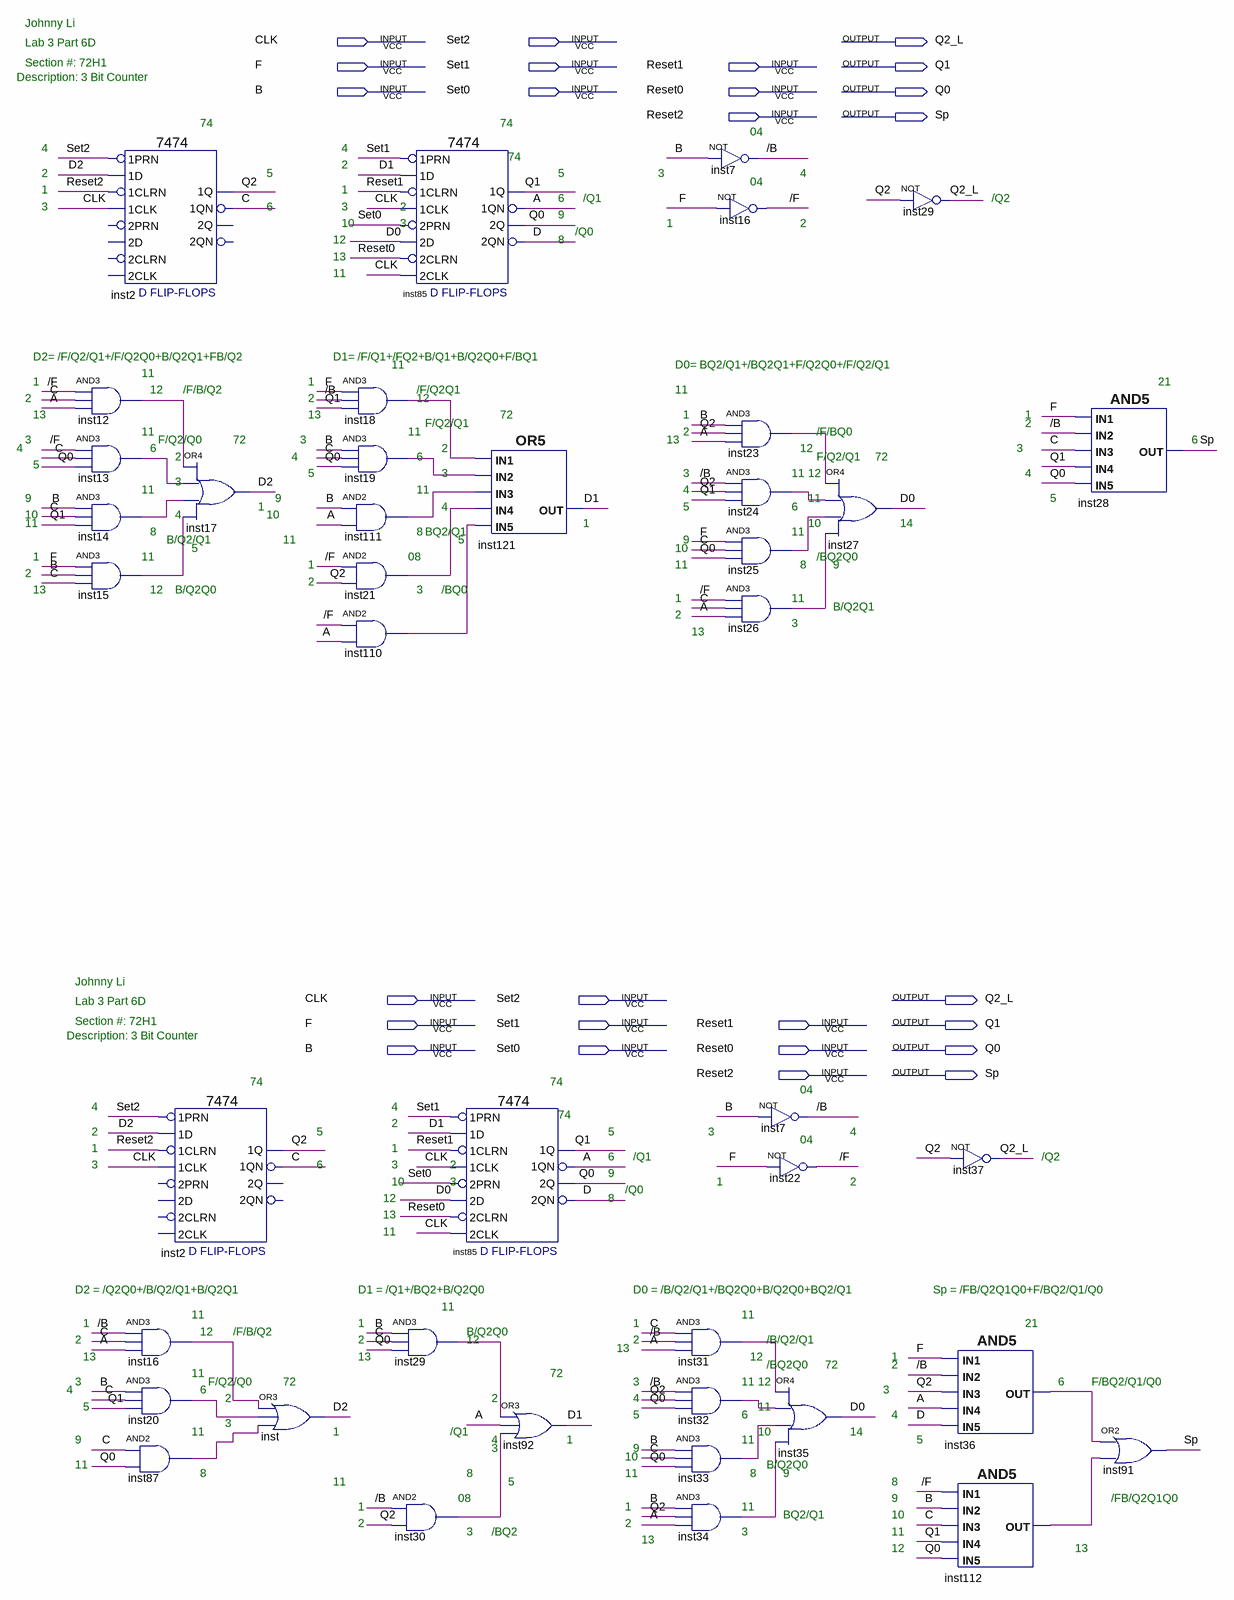
[diagram p0: schematic sheet]
// Quartus schematic test.bdf as structural Verilog: 42 symbols, 26 pins
module test (
  input  CLK,
  input  Set2,
  input  F,
  input  Set1,
  input  Reset1,
  input  B,
  input  Set0,
  input  Reset0,
  input  Reset2,
  output Q2_L,
  output Q1,
  output Q0,
  output Sp
);

  wire \/B , \/F , A, C, D, D0, D1, D2, inst12_out, inst13_out, inst14_out, inst15_out, inst16_out,
       inst18_out, inst19_out, inst20_out, inst21_out, inst23_out, inst24_out, inst25_out, inst26_out,
       inst29_out, inst30_out, inst31_out, inst32_out, inst33_out, inst34_out, inst36_out, inst87_out,
       inst110_out, inst111_out, inst112_out, Q2;

  \7474  inst2 (
    .\1CLK (CLK), .\1D (D2), .\1PRN (Set2), .\1CLRN (Reset2), .\1QN (C), .\1Q (Q2));  // open: 2D, 2PRN, 2CLK, 2CLRN, 2Q, 2QN
  and inst12 (inst12_out, \/F , C, A);
  and inst13 (inst13_out, \/F , C, Q0);
  and inst14 (inst14_out, B, C, Q1);
  and inst15 (inst15_out, F, B, C);
  and inst16 (inst16_out, \/B , C, A);
  and inst20 (inst20_out, B, C, Q1);
  and inst87 (inst87_out, C, Q0);
  or inst17 (D2, inst12_out, inst13_out, inst14_out, inst15_out);
  \7474  inst2_dup2 (
    .\1CLK (CLK), .\1D (D2), .\1PRN (Set2), .\1CLRN (Reset2), .\1QN (C), .\1Q (Q2));  // open: 2D, 2PRN, 2CLK, 2CLRN, 2Q, 2QN
  or inst (D2, inst16_out, inst20_out, inst87_out);
  and inst18 (inst18_out, F, \/B , Q1);
  and inst19 (inst19_out, B, C, Q0);
  and inst111 (inst111_out, B, A);
  and inst21 (inst21_out, \/F , Q2);
  and inst110 (inst110_out, \/F , A);
  and inst29 (inst29_out, B, C, Q0);
  and inst30 (inst30_out, \/B , Q2);
  \7474  inst85 (
    .\2D (D0), .\2PRN (Set0), .\1CLK (CLK), .\1D (D1), .\1PRN (Set1), .\2CLK (CLK), .\2CLRN (Reset0),
    .\1CLRN (Reset1), .\1QN (A), .\2Q (Q0), .\2QN (D), .\1Q (Q1));
  \7474  inst85_dup2 (
    .\2D (D0), .\2PRN (Set0), .\1CLK (CLK), .\1D (D1), .\1PRN (Set1), .\2CLK (CLK), .\2CLRN (Reset0),
    .\1CLRN (Reset1), .\1QN (A), .\2Q (Q0), .\2QN (D), .\1Q (Q1));
  or inst121 (D1, inst18_out, inst19_out, inst111_out, inst21_out, inst110_out);
  or inst92 (D1, inst29_out, A, inst30_out);
  not inst7 (\/B , B);
  not inst16_dup2 (\/F , F);
  and inst23 (inst23_out, B, Q2, A);
  and inst24 (inst24_out, \/B , Q2, Q1);
  and inst25 (inst25_out, F, C, Q0);
  and inst26 (inst26_out, \/F , C, A);
  and inst31 (inst31_out, C, \/B , A);
  and inst32 (inst32_out, \/B , Q2, Q0);
  and inst33 (inst33_out, B, C, Q0);
  and inst34 (inst34_out, B, Q2, A);
  not inst7_dup2 (\/B , B);
  not inst22 (\/F , F);
  or inst35 (D0, inst31_out, inst32_out, inst33_out, inst34_out);
  or inst27 (D0, inst23_out, inst24_out, inst25_out, inst26_out);
  not inst29_dup2 (Q2_L, Q2);
  not inst37 (Q2_L, Q2);
  and inst36 (inst36_out, F, \/B , Q2, A, D);
  and inst112 (inst112_out, \/F , B, C, Q1, Q0);
  and inst28 (Sp, F, \/B , C, Q1, Q0);
  or inst91 (Sp, inst36_out, inst112_out);

  // Notes on the sheet:
  //   Johnny Li 
  //   Lab 3 Part 6D 
  //   Section #: 72H1
  //   Description: 3 Bit Counter
  //   74
  //   74
  //   04
  //   4
  //   4
  //   74
  //   2
  //   2
  //   5
  //   5
  //   3
  //   4
  //   04
  //   1
  //   1
  //   6
  //   /Q1
  //   /Q2
  //   3
  //   6
  //   3
  //   2
  //   9
  //   10
  //   3
  //   1
  //   2
  //   /Q0
  //   12
  //   8
  //   13
  //   11
  //   D2= /F/Q2/Q1+/F/Q2Q0+B/Q2Q1+FB/Q2
  //   D1= /F/Q1+/FQ2+B/Q1+B/Q2Q0+F/BQ1
  //   11
  //   D0= BQ2/Q1+/BQ2Q1+F/Q2Q0+/F/Q2/Q1
  //   11
  //   1
  //   1
  //   21
  //   12
  //   /F/B/Q2
  //   /F/Q2Q1
  //   11
  //   2
  //   2
  //   12
  //   13
  //   13
  //   72
  //   1
  //   1
  //   F/Q2/Q1
  //   2
  //   11
  //   11
  //   2
  //   /F/BQ0
  //   3
  //   F/Q2/Q0
  //   72
  //   3
  //   13
  //   6
  //   4
  //   6
  //   2
  //   12
  //   3
  //   2
  //   4
  //   6
  //   F/Q2/Q1
  //   72
  //   5
  //   5
  //   3
  //   3
  //   11
  //   12
  //   4
  //   3
  //   11
  //   11
  //   4
  //   9
  //   9
  //   11
  //   5
  //   1
  //   4
  //   5
  //   6
  //   10
  //   4
  //   10
  //   11
  //   1
  //   10
  //   14
  //   8
  //   8
  //   BQ2/Q1
  //   11
  //   B/Q2/Q1
  //   11
  //   5
  //   9
  //   5
  //   10
  //   1
  //   11
  //   08
  //   /BQ2Q0
  //   1
  //   11
  //   8
  //   9
  //   2
  //   2
  //   13
  //   12
  //   B/Q2Q0
  //   3
  //   /BQ0
  //   1
  //   11
  //   B/Q2Q1
  //   2
  //   3
  //   13
  //   Johnny Li 
  //   Lab 3 Part 6D 
  //   Section #: 72H1
  //   Description: 3 Bit Counter
  //   74
  //   74
  //   04
  //   4
  //   4
  //   74
  //   2
  //   2
  //   5
  //   5
  //   3
  //   4
  //   04
  //   1
  //   1
  //   6
  //   /Q1
  //   /Q2
  //   3
  //   6
  //   3
  //   2
  //   9
  //   10
  //   3
  //   1
  //   2
  //   /Q0
  //   12
  //   8
  //   13
  //   11
  //   D2 = /Q2Q0+/B/Q2/Q1+B/Q2Q1
  //   D1 = /Q1+/BQ2+B/Q2Q0
  //   D0 = /B/Q2/Q1+/BQ2Q0+B/Q2Q0+BQ2/Q1
  //   Sp = /FB/Q2Q1Q0+F/BQ2/Q1/Q0
  //   11
  //   11
  //   11
  //   1
  //   1
  //   1
  //   21
  //   12
  //   /F/B/Q2
  //   B/Q2Q0
  //   2
  //   2
  //   12
  //   2
  //   /B/Q2/Q1
  //   13
  //   13
  //   13
  //   12
  //   1
  //   /BQ2Q0
  //   72
  //   2
  //   11
  //   72
  //   3
  //   F/Q2/Q0
  //   72
  //   3
  //   11
  //   12
  //   6
  //   F/BQ2/Q1/Q0
  //   4
  //   6
  //   3
  //   2
  //   2
  //   4
  //   5
  //   11
  //   5
  //   6
  //   4
  //   3
  //   11
  //   1
  //   /Q1
  //   10
  //   14
  //   9
  //   4
  //   1
  //   11
  //   5
  //   3
  //   9
  //   10
  //   11
  //   B/Q2Q0
  //   8
  //   8
  //   11
  //   8
  //   9
  //   11
  //   5
  //   8
  //   08
  //   9
  //    /FB/Q2Q1Q0
  //   1
  //   1
  //   11
  //   BQ2/Q1
  //   10
  //   2
  //   2
  //   3
  //   /BQ2
  //   3
  //   11
  //   13
  //   12
  //   13
endmodule
